# Altium schematic sheet Sema.SchDoc
size 304 x 241 mm
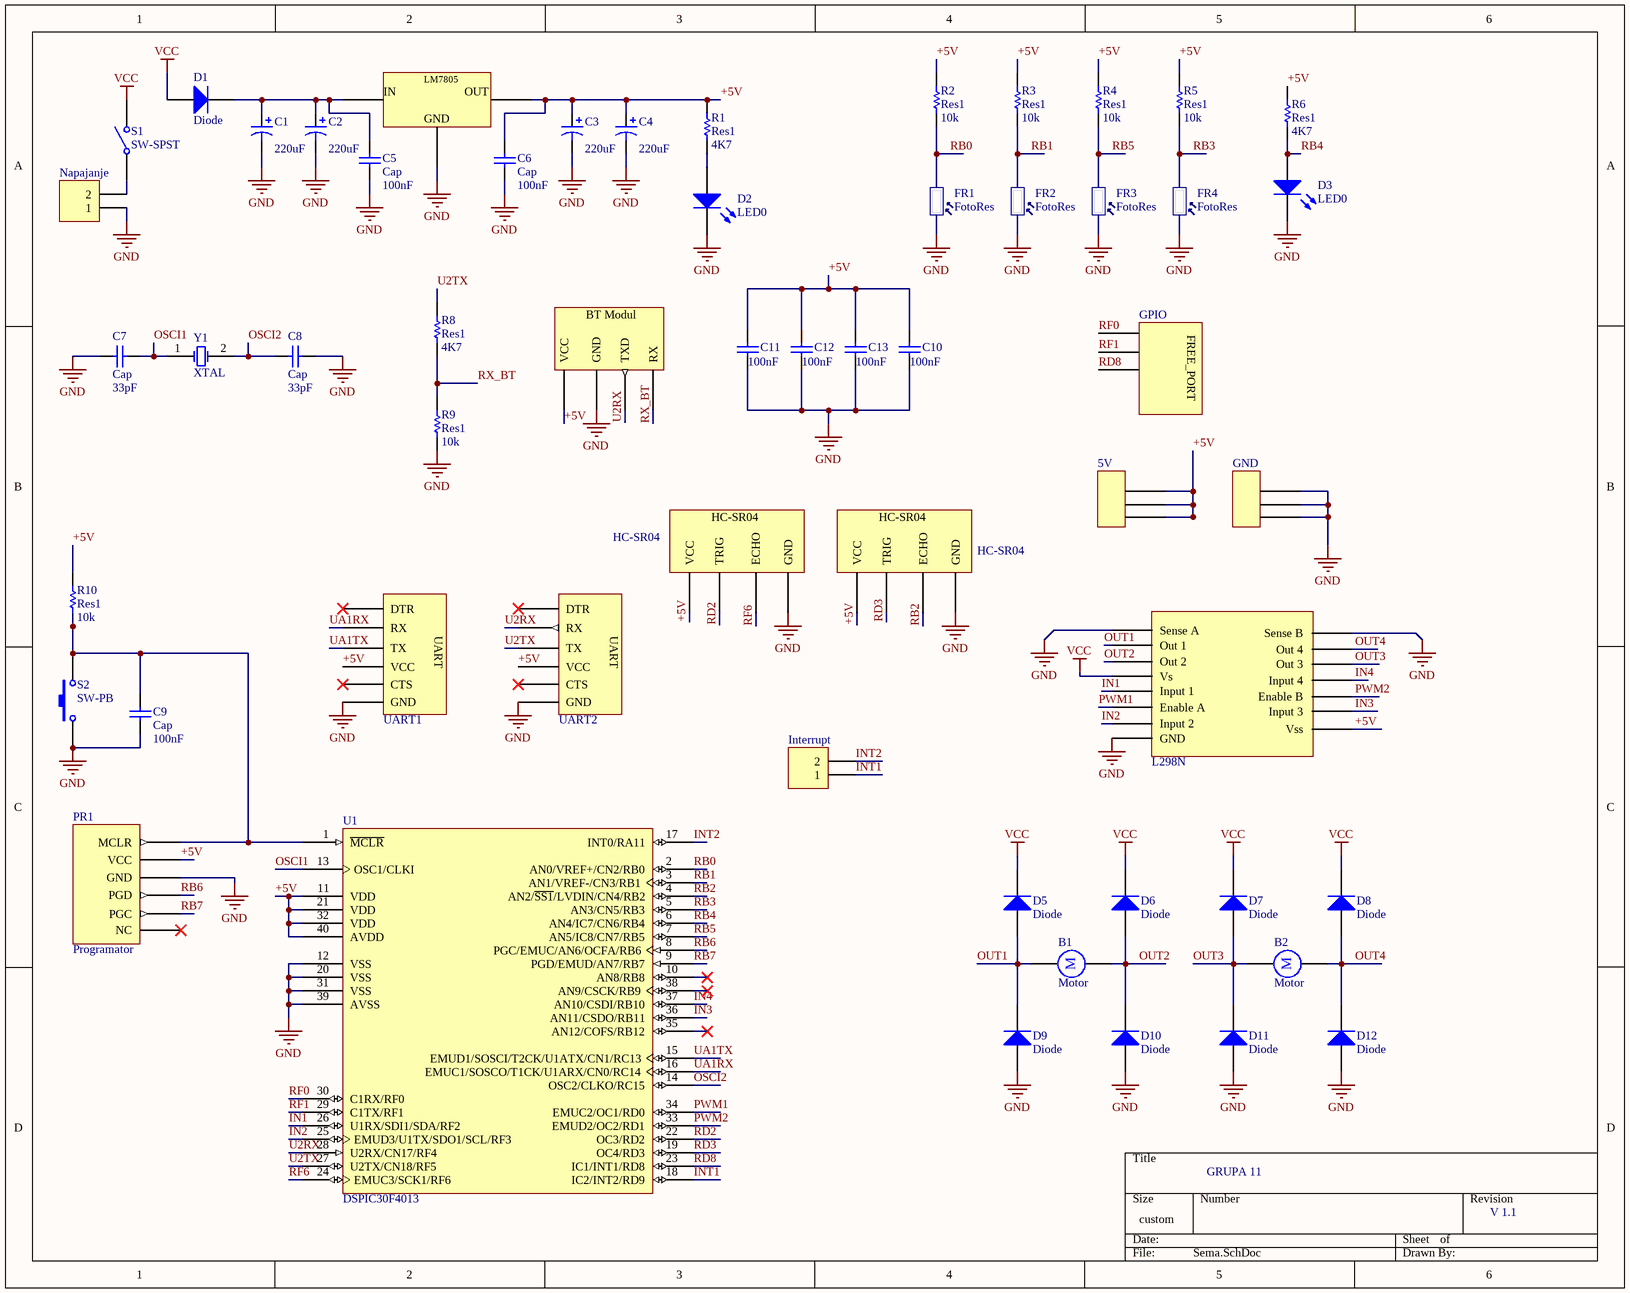
[diagram p0: Sema.SchDoc]

## Parts
5V  POWER1  [MOST3]  (value not drawn)
B1  Motor  [Kleam]
B2  Motor  [Kleam]
BT_modul  BT-modul  [BT_CON]  (value not drawn)
C1  value 220uF  [CAP-rad]  (hidden comment: Cap Pol1)
C2  value 220uF  [CAP-rad]  (hidden comment: Cap Pol1)
C3  value 220uF  [CAP-rad]  (hidden comment: Cap Pol1)
C4  value 220uF  [CAP-rad]  (hidden comment: Cap Pol1)
C5  Cap  value 100nF  [CAP-200x80]
C6  Cap  value 100nF  [CAP-200x80]
C7  Cap  value 33pF  [CAP-200x80]
C8  Cap  value 33pF  [CAP-200x80]
C9  Cap  value 100nF  [CAP-200x80]
C10  value 100nF  [CAP-200x80]  (hidden comment: Cap)
C11  value 100nF  [CAP-200x80]  (hidden comment: Cap)
C12  value 100nF  [CAP-200x80]  (hidden comment: Cap)
C13  value 100nF  [CAP-200x80]  (hidden comment: Cap)
D1  Diode  [DIOD430X80]
D2  LED0  [LED200mil]
D3  LED0  [LED200mil]
D5  Diode  [DIOD430X80]
D6  Diode  [DIOD430X80]
D7  Diode  [DIOD430X80]
D8  Diode  [DIOD430X80]
D9  Diode  [DIOD430X80]
D10  Diode  [DIOD430X80]
D11  Diode  [DIOD430X80]
D12  Diode  [DIOD430X80]
FR1  FotoRes  [MOST2]
FR2  FotoRes  [MOST2]
FR3  FotoRes  [MOST2]
FR4  FotoRes  [MOST2]
GND  POWER2  [MOST3]  (value not drawn)
GPIO  FREE_PORT  [MOST3]  (value not drawn)
HC-SR04-2  HC-SR04  [MOST4]
HC-SR04_1  HC-SR04  [MOST4]
Interrupt  Imterrupt  [MOST2]  (value not drawn)
L298N  L298N  [TO127P2020X500X2100-15]
LM  LM7805  [LM7805]  (value not drawn)
Napajanje  Napajanje  [Kleam]  (value not drawn)
PR1  Programator  [PIC-PROGRAMATOR]
R1  Res1  value 4K7  [R430x80]
R2  Res1  value 10k  [R430x80]
R3  Res1  value 10k  [R430x80]
R4  Res1  value 10k  [R430x80]
R5  Res1  value 10k  [R430x80]
R6  Res1  value 4K7  [R430x80]
R8  Res1  value 4K7  [R430x80]
R9  Res1  value 10k  [R430x80]
R10  Res1  value 10k  [R430x80]
S1  SW-SPST  [PREKIDAC]
S2  SW-PB  [TASTER]
U1  DSPIC30F4013  [DIP254P1524X635-40]
UART1  UART1  [MOST6]
UART2  UART2  [MOST6]
Y1  XTAL  [XTAL]

## Nets
GND: BT_modul.1(GND) C1.2 C2.2 C3.2 C4.2 C5.2 C6.2 C7.2 C8.1 C9.1 C10.2 C11.2 C12.2 C13.2 D2.2(K) D3.2(K) D9.1(A) D10.1(A) D11.1(A) D12.1(A) FR1.1 FR2.1 FR3.1 FR4.1 GND.0 GND.1 GND.2 HC-SR04-2.1(GND) HC-SR04_1.1(GND) L298N.1(Sense_A) L298N.8(GND) L298N.15(Sense_B) LM.2 Napajanje.1 PR1.3(GND) R9.1 S2.1 U1.12(VSS) U1.20(VSS) U1.31(VSS) U1.39(AVSS) UART1.5(GND) UART2.5(GND)
VCC: D1.1(A) D5.2(K) D6.2(K) D7.2(K) D8.2(K) L298N.4(Vs) S1.2(NO)
+5V: 5V.0 5V.1 5V.2 BT_modul.0(VCC) C3.1 C4.1 C6.1 C10.1 C11.1 C12.1 C13.1 HC-SR04-2.4(VCC) HC-SR04_1.4(VCC) L298N.9(Vss) LM.3 PR1.2(VCC) R1.2 R2.2 R3.2 R4.2 R5.2 R6.2 R10.2 U1.11(VDD) U1.21(VDD) U1.32(VDD) U1.40(AVDD) UART1.3(VCC) UART2.3(VCC)
IN1: L298N.5(Input_1) U1.26(U1RX/SDI1/SDA/RF2)
IN2: L298N.7(Input_2) U1.25(EMUD3/U1TX/SDO1/SCL/RF3)
IN3: L298N.10(Input_3) U1.36(AN11/CSDO/RB11)
IN4: L298N.12(Input_4) U1.37(AN10/CSDI/RB10)
INT1: Interrupt.1 U1.18(IC2/INT2/RD9)
INT2: Interrupt.2 U1.17(INT0/RA11)
OSCI1: C7.1 U1.13(OSC1/CLKI) Y1.1(OSC1)
OSCI2: C8.2 U1.14(OSC2/CLKO/RC15) Y1.2(OSC2)
OUT1: B1.1 D5.1(A) D9.2(K) L298N.2(Out_1)
OUT2: B1.2 D6.1(A) D10.2(K) L298N.3(Out_2)
OUT3: B2.1 D7.1(A) D11.2(K) L298N.13(Out_3)
OUT4: B2.2 D8.1(A) D12.2(K) L298N.14(Out_4)
PWM1: L298N.6(Enable_A) U1.34(EMUC2/OC1/RD0)
PWM2: L298N.11(Enable_B) U1.33(EMUD2/OC2/RD1)
RB0: FR1.2 R2.1 U1.2(AN0/VREF+/CN2/RB0)
RB1: FR2.2 R3.1 U1.3(AN1/VREF-/CN3/RB1)
RB2: HC-SR04_1.2(ECHO) U1.4(AN2/~{SS1}/LVDIN/CN4/RB2)
RB3: FR4.2 R5.1 U1.5(AN3/CN5/RB3)
RB4: D3.1(A) R6.1 U1.6(AN4/IC7/CN6/RB4)
RB5: FR3.2 R4.1 U1.7(AN5/IC8/CN7/RB5)
RB6: PR1.4(PGD) U1.8(PGC/EMUC/AN6/OCFA/RB6)
RB7: PR1.5(PGC) U1.9(PGD/EMUD/AN7/RB7)
RD2: HC-SR04-2.3(TRIG) U1.22(OC3/RD2)
RD3: HC-SR04_1.3(TRIG) U1.19(OC4/RD3)
RD8: GPIO.2 U1.23(IC1/INT1/RD8)
RF0: GPIO.0 U1.30(C1RX/RF0)
RF1: GPIO.1 U1.29(C1TX/RF1)
RF6: HC-SR04-2.2(ECHO) U1.24(EMUC3/SCK1/RF6)
RX_BT: BT_modul.3(RX) R8.1 R9.2
U2RX: BT_modul.2(TXD) U1.28(U2RX/CN17/RF4) UART2.1(RX)
U2TX: R8.2 U1.27(U2TX/CN18/RF5) UART2.2(TX)
UA1RX: U1.16(EMUC1/SOSCO/T1CK/U1ARX/CN0/RC14) UART1.1(RX)
UA1TX: U1.15(EMUD1/SOSCI/T2CK/U1ATX/CN1/RC13) UART1.2(TX)
NetC1_1: C1.1 C2.1 C5.1 D1.2(K) LM.1
NetC9_2: C9.2 PR1.1(MCLR) R10.1 S2.2 U1.1(~{MCLR})
NetD2_1: D2.1(A) R1.1
NetNapajanje_2: Napajanje.2 S1.1(COMMON)

Not connected (* = marked no-connect by the designer): PR1 6(NC)*; U1 10(AN8/RB8)* 35(AN12/COFS/RB12)* 38(AN9/CSCK/RB9)*; UART1 0(DTR)* 4(CTS)*; UART2 0(DTR)* 4(CTS)*

## Notes on the sheet
- GRUPA 11
- V 1.1
- (in symbol BT-modul) BT Modul
- (in symbol LM7805) IN; OUT; GND
- (in symbol Motor) M

## Library data of the parts
5V GND = POWER
B1 B2 = Motor: Motor, General Kind; Published: 24-Mar-1999; LatestRevisionDate: 17-Jul-2002; LatestRevisionNote: Re-released for DXP Platform.; PackageReference: RB5-10.5; Publisher: Altium Limited; PackageDescription: Capacitor (Radial); 2 Leads
C1-C4 = Cap Pol1: Polarized Capacitor (Radial); Published: 8-Jun-2000; LatestRevisionDate: 17-Jul-2002; LatestRevisionNote: Re-released for DXP Platform.; PackageReference: RB7.6-15; Publisher: Altium Limited; PackageDescription: Polarized Capacitor (Radial); 2 Leads
C5-C13 = Cap: Capacitor; Published: 8-Jun-2000; LatestRevisionDate: 17-Jul-2002; LatestRevisionNote: Re-released for DXP Platform.; PackageReference: RAD-0.3; Publisher: Altium Limited; PackageDescription: Radial Cap, Thru-Hole; 2 Leads; 0.3 in Pin Spacing
D1 D5-D12 = Diode: Default Diode; Published: 8-Jun-2000; LatestRevisionDate: 17-Jul-2002; LatestRevisionNote: Re-released for DXP Platform.; PackageVersion: Sep-1996; PackageReference: SMC; Publisher: Altium Limited; PackageDescription: DO-214-AB/SMC; 2 C-Bend Leads; Body 7.9 x 5.9 mm, inc. leads (LxW); Code_JEDEC: DO-214-AB
D2 D3 = LED0: Typical INFRARED GaAs LED; Published: 8-Jun-2000; LatestRevisionDate: 08-Jul-2005; LatestRevisionNote: Mech Layer 1 removed.; PackageReference: LED-0; Publisher: Altium Limited; PackageDescription: LED; 2 Leads
Interrupt Napajanje = Header 2: Header, 2-Pin; LatestRevisionDate: 17-Jul-2002; LatestRevisionNote: Re-released for DXP Platform.; Publisher: Altium Limited
R1-R6 R8-R10 = Res1: Resistor; Published: 8-Jun-2000; LatestRevisionDate: 17-Jul-2002; LatestRevisionNote: Re-released for DXP Platform.; PackageReference: AXIAL-0.3; Publisher: Altium Limited; PackageDescription: Axial Device, Thru-Hole; 2 Leads; 0.3 in Pin Spacing
S1 = SW-SPST: Single-Pole, Single-Throw Switch; Published: 24-Mar-1999; LatestRevisionDate: 17-Jul-2002; LatestRevisionNote: Re-released for DXP Platform.; PackageReference: SPST-2; Publisher: Altium Limited; PackageDescription: Switch; 2 Leads
S2 = SW-PB: Switch; Published: 24-Mar-1999; LatestRevisionDate: 17-Jul-2002; LatestRevisionNote: Re-released for DXP Platform.; PackageReference: SPST-2; Publisher: Altium Limited; PackageDescription: Switch; 2 Leads
U1 = DSPIC30F4013-20I/P: High-Performance 16-bit Digital Signal Controller, 48 KB Flash, 2 KB SRAM, 1 KB EEPROM, 40-Pin PDIP, Industrial Temperature; Published: 29-Jan-2009; DatasheetVersion: revF, Apr-2008; PackageVersion: revBB, Aug-2009; PackageReference: PDIP600-P40; Publisher: Altium Limited; PackageDescription: 40-Lead Plastic Dual In-Line (P) - 600 mil Body [PDIP]; Supplier 1: Digi-Key; Supplier Part Number 1: DSPIC30F4013-20IP-ND; Supplier 2: Farnell; Supplier Part Number 2: 1439755; ComponentLink1Description: Datasheet; ComponentLink1URL: http://ww1.microchip.com/downloads/en/DeviceDoc/70138F.pdf; ComponentLink2Description: Packaging Specification; ComponentLink2URL: http://www.microchip.com/stellent/groups/techpub_sg/documents/packagingspec/en012702.pdf; ComponentLink3Description: Microchip.com Home; ComponentLink3URL: http://www.microchip.com/
UART1 UART2 = UART
Y1 = XTAL: Crystal Oscillator; Published: 8-Jun-2000; LatestRevisionDate: 17-Jul-2002; LatestRevisionNote: Re-released for DXP Platform.; PackageReference: R38; Publisher: Altium Limited; PackageDescription: Crystal, Thru-Hole; 2 Leads; Body 3.1 x 8.2 mm (Dia.xH)